# Altium schematic sheet Device.SchDoc
size A4
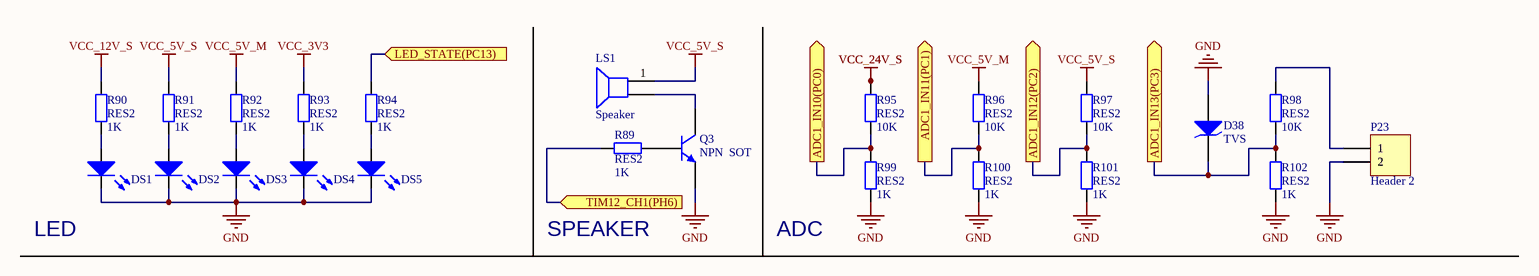
[diagram p0: Device.SchDoc]

## Parts
D38  TVS  [SOD-523]
DS1  LED  [LED 0805B]  (value not drawn)
DS2  LED  [LED 0805B]  (value not drawn)
DS3  LED  [LED 0805B]  (value not drawn)
DS4  LED  [LED 0805B]  (value not drawn)
DS5  LED  [LED 0805B]  (value not drawn)
LS1  Speaker  [BEEP 5x9x5.5]
P23  Header 2  [HDR2.54-LI-2P]
Q3  NPN  SOT  [SOT23-3L]
R89  RES2  value 1K  [R 0805_L]
R90  RES2  value 1K  [R 0805_L]
R91  RES2  value 1K  [R 0805_L]
R92  RES2  value 1K  [R 0805_L]
R93  RES2  value 1K  [R 0805_L]
R94  RES2  value 1K  [R 0805_L]
R95  RES2  value 10K  [R 0805_L]
R96  RES2  value 10K  [R 0805_L]
R97  RES2  value 10K  [R 0805_L]
R98  RES2  value 10K  [R 0805_L]
R99  RES2  value 1K  [R 0805_L]
R100  RES2  value 1K  [R 0805_L]
R101  RES2  value 1K  [R 0805_L]
R102  RES2  value 1K  [R 0805_L]

## Ports
ADC1_IN10(PC0) (out), ADC1_IN11(PC1) (out), ADC1_IN12(PC2) (out), ADC1_IN13(PC3) (out), LED_STATE(PC13) (in), TIM12_CH1(PH6) (in)

## Nets
GND: D38.1(A) DS1.2(K) DS2.2(K) DS3.2(K) DS4.2(K) DS5.2(K) P23.2 Q3.2(E) R99.1 R100.1 R101.1 R102.1
VCC_3V3: R93.2
VCC_5V_M: R92.2 R96.2
VCC_5V_S: LS1.1 R91.2 R97.2
VCC_12V_S: R90.2
VCC_24V_S: R95.2
ADC1_IN10(PC0): R95.1 R99.2 ; port ADC1_IN10(PC0)
ADC1_IN11(PC1): R96.1 R100.2 ; port ADC1_IN11(PC1)
ADC1_IN12(PC2): R97.1 R101.2 ; port ADC1_IN12(PC2)
ADC1_IN13(PC3): D38.2(K) R98.1 R102.2 ; port ADC1_IN13(PC3)
LED_STATE(PC13): R94.2 ; port LED_STATE(PC13)
TIM12_CH1(PH6): R89.2 ; port TIM12_CH1(PH6)
NetDS1_1: DS1.1(A) R90.1
NetDS2_1: DS2.1(A) R91.1
NetDS3_1: DS3.1(A) R92.1
NetDS4_1: DS4.1(A) R93.1
NetDS5_1: DS5.1(A) R94.1
NetLS1_2: LS1.2 Q3.3(C)
NetP23_1: P23.1 R98.2
NetQ3_1: Q3.1(B) R89.1

## Notes on the sheet
- LED
- SPEAKER
- ADC

## Library data of the parts
D38 = D: High Conductance Fast Diode; Published: 8-Jun-2000; LatestRevisionDate: 17-Jul-2002; LatestRevisionNote: Re-released for DXP Platform.; DatasheetVersion: 1997; PackageReference: DO-35; Publisher: Altium Limited; PackageDescription: Diode, Axial; Body 3.8 x 1.9 mm (LxDia. max), Lead Dia. 0.53 mm (max); Code_JEDEC: DO-204-AH; ComponentLink1Description: Manufacturer Link; ComponentLink1URL: http://www.fairchildsemi.com/; ComponentLink2Description: Datasheet; ComponentLink2URL: http://www.fairchildsemi.com/ds/1N%2F1N4148.pdf
LS1 = Speaker: Loudspeaker; Published: 24-Mar-1999; LatestRevisionDate: 17-Jul-2002; LatestRevisionNote: Re-released for DXP Platform.; PackageReference: PIN2; Publisher: Altium Limited
P23 = Header 2: Header, 2-Pin; LatestRevisionDate: 17-Jul-2002; LatestRevisionNote: Re-released for DXP Platform.; Publisher: Altium Limited
Q3 = NPN  SOT: NPN Bipolar Transistor; Published: 8-Jun-2000; LatestRevisionDate: 17-Jul-2002; LatestRevisionNote: Re-released for DXP Platform.; PackageReference: TO-226-AA; Publisher: Altium Limited; PackageDescription: TO, Flat Index; 3 In-Line, Axial Leads; Body Dia. 4.8mm; Leads 0.55 x 0.51 mm (max); Code_JEDEC: TO-226-AA
R89-R102 = RES2: Resistor; Published: 8-Jun-2000; LatestRevisionDate: 17-Jul-2002; LatestRevisionNote: Re-released for DXP Platform.; PackageReference: AXIAL-0.3; Publisher: Altium Limited; PackageDescription: Axial Device, Thru-Hole; 2 Leads; 0.3 in Pin Spacing